# EAGLE schematic bat_mini_drby_2018 (EAGLE 9.1.2)
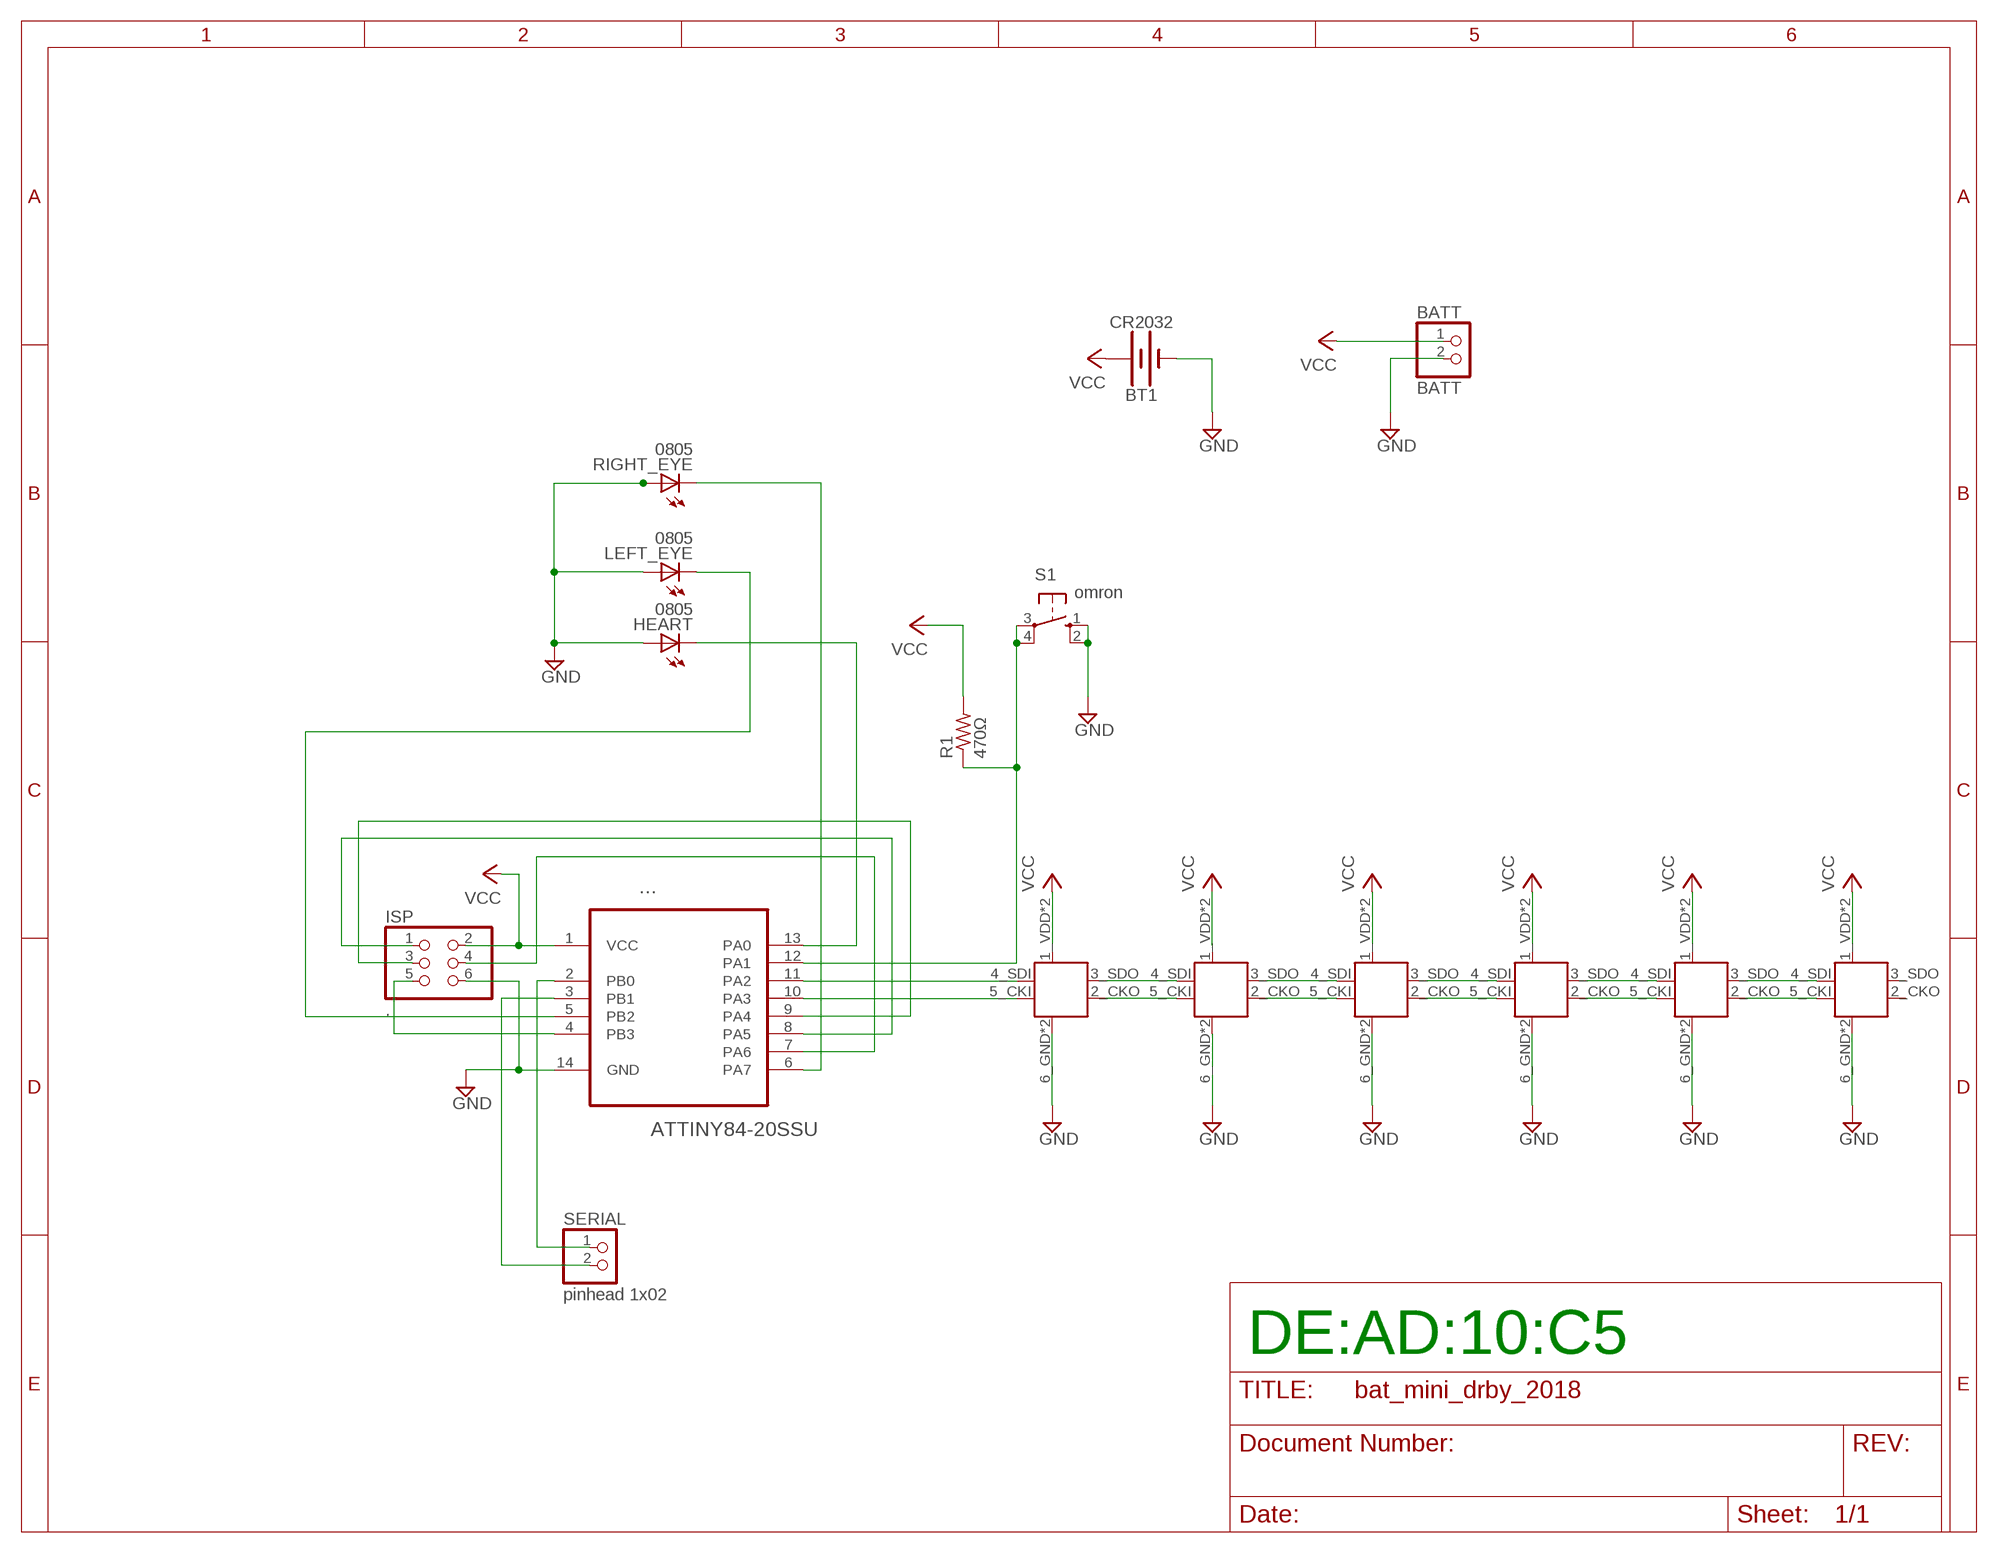
[diagram p0: schematic, sheet 1]

## Parts
...  ATTINY84-20SSU  [SOIC127P600X175-14N]
BATT  BATT  PINHD-1X2  [1X02]
BT1  CR2032  BATTERY-20MM_SMD_4LEGS  [BATTCON_20MM_4LEGS]
HEART  0805  LEDCHIP-LED0805  [CHIP-LED0805]
ISP  .  PINHD-2X3  [2X03]
LEFT_EYE  0805  LEDCHIP-LED0805  [CHIP-LED0805]
R1  470Ω  R-US_R0805  [R0805]
RIGHT_EYE  0805  LEDCHIP-LED0805  [CHIP-LED0805]
S1  omron  10-XX  [B3F-10XX]
SERIAL  pinhead 1x02  PINHD-1X2  [1X02]
U$4  APA102  [APA102-2020]
U$8  APA102  [APA102-2020]
U$9  APA102  [APA102-2020]
U$10  APA102  [APA102-2020]
U$11  APA102  [APA102-2020]
U$12  APA102  [APA102-2020]

## Nets
GND: ....14(GND) BATT.2 BT1.NEGATIVE(-) HEART.A ISP.6 LEFT_EYE.A RIGHT_EYE.A S1.1(S) S1.2(S1) U$4.6_GND(GND) U$4.GNDPAD(GND) U$8.6_GND(GND) U$8.GNDPAD(GND) U$9.6_GND(GND) U$9.GNDPAD(GND) U$10.6_GND(GND) U$10.GNDPAD(GND) U$11.6_GND(GND) U$11.GNDPAD(GND) U$12.6_GND(GND) U$12.GNDPAD(GND)
N$1: ....2(PB0) SERIAL.1
N$2: ....5(PB2) LEFT_EYE.C
N$3: ....8(PA5) ISP.1
N$4: ....7(PA6) ISP.4
N$5: ....9(PA4) ISP.3
N$6: ....4(PB3) ISP.5
N$7: ....6(PA7) RIGHT_EYE.C
N$8: ....13(PA0) HEART.C
N$9: ....11(PA2) U$4.4_SDI(SDI)
N$10: ....10(PA3) U$4.5_CKI(CKI)
N$12: ....12(PA1) R1.1 S1.3(P) S1.4(P1)
N$15: ....3(PB1) SERIAL.2
N$17: U$4.3_SDO(SDO) U$8.4_SDI(SDI)
N$18: U$4.2_CKO(CKO) U$8.5_CKI(CKI)
N$25: U$8.3_SDO(SDO) U$9.4_SDI(SDI)
N$26: U$8.2_CKO(CKO) U$9.5_CKI(CKI)
N$27: U$9.3_SDO(SDO) U$10.4_SDI(SDI)
N$28: U$9.2_CKO(CKO) U$10.5_CKI(CKI)
N$29: U$10.3_SDO(SDO) U$11.4_SDI(SDI)
N$30: U$10.2_CKO(CKO) U$11.5_CKI(CKI)
N$31: U$11.3_SDO(SDO) U$12.4_SDI(SDI)
N$32: U$11.2_CKO(CKO) U$12.5_CKI(CKI)
VCC: ....1(VCC) BATT.1 BT1.POSITIVE@1(+) BT1.POSITIVE@2(+) BT1.POSITIVE@3(+) BT1.POSITIVE@4(+) ISP.2 R1.2 U$4.1_VDD(VCC) U$4.VDDPAD(VCC) U$8.1_VDD(VCC) U$8.VDDPAD(VCC) U$9.1_VDD(VCC) U$9.VDDPAD(VCC) U$10.1_VDD(VCC) U$10.VDDPAD(VCC) U$11.1_VDD(VCC) U$11.VDDPAD(VCC) U$12.1_VDD(VCC) U$12.VDDPAD(VCC)
Unconnected: U$12.2_CKO(CKO) U$12.3_SDO(SDO)

## Notes on the sheet
- DE:AD:10:C5

## Library data of the parts
... = Atmel_By_element14_Batch_1-00:ATTINY84-20SSU: 8-bit Microcontroller with Bytes In-System Programmable Flash; OC_FARNELL: 1636955; OC_NEWARK: 03P2040; PACKAGE: SOIC-14; SUPPLIER: Atmel
BATT SERIAL = pinhead:PINHD-1X2: PIN HEADER
BT1 = SF_Batteries:BATTERY: Battery - Single Cell A variety of battery chemistries, sizes, and footprints. Device List: 20MM_PTH - Coin Cell Battery Holder - 20mm (PTH) <https://www.sparkfun.com/products/783> 12MM_SMD - Coin Cell Battery Holder - 12mm (SMD) <https://www.sparkfun.com/products/10592> 12MM_PTH - Coin Cell Battery Holder - 12mm (PTH) <https://www.sparkfun.com/products/7948> 20MM_SMD - 20mm Coin Cell Battery Holder (SMD) (2 legs) Used on the Big Time Watch Kit <https://www.sparkfun.com/products/11734> 20MM_SMD_4LEGS - Coin Cell Battery Holder - 20mm (SMD) <https://www.sparkfun.com/products/11892> 20MM_SMD_4LEGS_OVERPASTE - Coin Cell Battery Holder - 20mm (SMD) <https://www.sparkfun.com/products/11892> (Over-paste on the legs) 24.5MM_PTH - Coin Cell Battery Holder - 24.5mm (PTH) <https://www.sparkfun.com/products/8863> 9V - 9V Battery Holder - PC Mount Used on the SparkFun SparkPunk Sound Kit <https://www.sparkfun.com/products/11177> and SparkFun SparkPunk Sequencer Kit <https://www.sparkfun.com/products/12707> 18650 - Battery Holder - 18650 (PTH) <https://www.sparkfun.com/products/13113> AA - Battery Holder - 1xAA (PTH) <https://www.sparkfun.com/products/7949> AAA - Battery Holder - 1xAAA (PTH) <https://www.sparkfun.com/products/12718> AA_KIT - Battery Holder - 1xAA (PTH) <https://www.sparkfun.com/products/7949> Special kit package - pads only have exposed copper on one side of the board. AAA_KIT - Battery Holder - 1xAAA (PTH) <https://www.sparkfun.com/products/12718> Special kit package - pads only have exposed copper on one side of the board.; PROD_ID: BATT-10373; SF_SKU: PRT-11892
HEART LEFT_EYE RIGHT_EYE = led:LED: LED OSRAM: - CHIPLED LG R971, LG N971, LY N971, LG Q971, LY Q971, LO R971, LY R971 LH N974, LH R974 LS Q976, LO Q976, LY Q976 LO Q996 - Hyper CHIPLED LW Q18S LB Q993, LB Q99A, LB R99A - SideLED LS A670, LO A670, LY A670, LG A670, LP A670 LB A673, LV A673, LT A673, LW A673 LH A674 LY A675 LS A676, LA A676, LO A676, LY A676, LW A676 LS A679, LY A679, LG A679 - Hyper Micro SIDELED® LS Y876, LA Y876, LO Y876, LY Y876 LT Y87S - SmartLED LW L88C, LW L88S LB L89C, LB L89S, LG L890 LS L89K, LO L89K, LY L89K LS L896, LA L896, LO L896, LY L896 - TOPLED LS T670, LO T670, LY T670, LG T670, LP T670 LSG T670, LSP T670, LSY T670, LOP T670, LYG T670 LG T671, LOG T671, LSG T671 LB T673, LV T673, LT T673, LW T673 LH T674 LS T676, LA T676, LO T676, LY T676, LB T676, LH T676, LSB T676, LW T676 LB T67C, LV T67C, LT T67C, LS T67K, LO T67K, LY T67K, LW E67C LS E67B, LA E67B, LO E67B, LY E67B, LB E67C, LV E67C, LT E67C LW T67C LS T679, LY T679, LG T679 LS T770, LO T770, LY T770, LG T770, LP T770 LB T773, LV T773, LT T773, LW T773 LH T774 LS E675, LA E675, LY E675, LS T675 LS T776, LA T776, LO T776, LY T776, LB T776 LHGB T686 LT T68C, LB T68C - Hyper Mini TOPLED® LB M676 - Mini TOPLED Santana® LG M470 LS M47K, LO M47K, LY M47K Source: http://www.osram.convergy.de LUXEON: - LUMILED® LXK2-PW12-R00, LXK2-PW12-S00, LXK2-PW14-U00, LXK2-PW14-V00 LXK2-PM12-R00, LXK2-PM12-S00, LXK2-PM14-U00 LXK2-PE12-Q00, LXK2-PE12-R00, LXK2-PE12-S00, LXK2-PE14-T00, LXK2-PE14-U00 LXK2-PB12-K00, LXK2-PB12-L00, LXK2-PB12-M00, LXK2-PB14-N00, LXK2-PB14-P00, LXK2-PB14-Q00 LXK2-PR12-L00, LXK2-PR12-M00, LXK2-PR14-Q00, LXK2-PR14-R00 LXK2-PD12-Q00, LXK2-PD12-R00, LXK2-PD12-S00 LXK2-PH12-R00, LXK2-PH12-S00 LXK2-PL12-P00, LXK2-PL12-Q00, LXK2-PL12-R00 Source: www.luxeon.com KINGBRIGHT: KA-3528ASYC Source: www.kingbright.com
ISP = pinhead:PINHD-2X3: PIN HEADER
R1 = resistor:R-US_: RESISTOR, American symbol
S1 = switch-omron:10-XX: OMRON SWITCH; MPN: B3F-1000; OC_FARNELL: 176432; OC_NEWARK: 36M3542
U$4 U$8-U$12 = pimoroni-optoelectronics:APA102